# Altium project HC32F005.PrjPCB
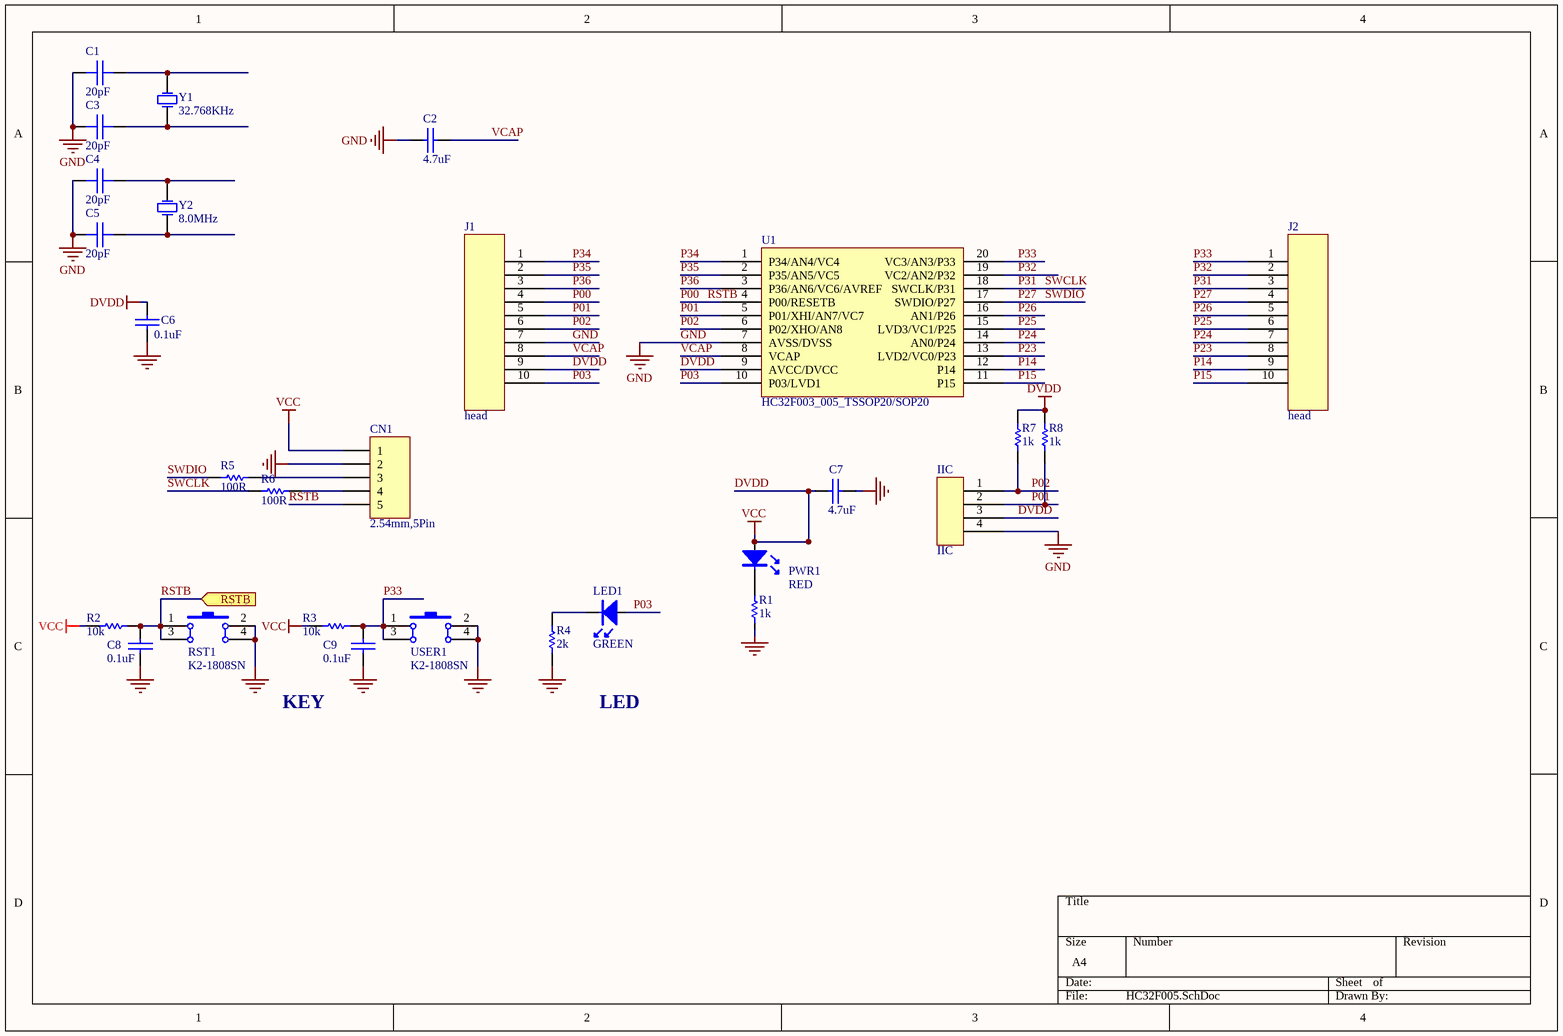
[diagram p0: HC32F005.SchDoc]
1 sheet, 28 parts. Net scope: flat (ports and power ports of the same name join across sheets).
Board file: HC32F005.PcbDoc

## Sheet HC32F005.SchDoc
size A4

### Parts
C1  20pF  [C0603]
C2  4.7uF  [C0603]
C3  20pF  [C0603]
C4  20pF  [C0603]
C5  20pF  [C0603]
C6  0.1uF  [C0603]
C7  4.7uF  [C0603]
C8  0.1uF  [C0603]
C9  0.1uF  [C0603]
CN1  2.54mm,5Pin  [HDR1X5]
IIC  IIC  [HDR1X4]
J1  head  [HDR1*10]
J2  head  [HDR1*10]
LED1  GREEN  [LED0603]
PWR1  RED  [LED0603]
R1  1k  [R0603]
R2  10k  [R0603]
R3  10k  [R0603]
R4  2k  [R0603]
R5  100R  [R0603]
R6  100R  [R0603]
R7  1k  [R0603]
R8  1k  [R0603]
RST1  K2-1808SN  [PUSHBUTTON-4.2*3.25]
U1  HC32F003_005_TSSOP20/SOP20  [TSSOP-20]
USER1  K2-1808SN  [PUSHBUTTON-4.2*3.25]
Y1  32.768KHz  [32.768K]
Y2  8.0MHz  [49s]

### Ports
RSTB (in)

### Nets
DVDD: C6.1 C7.1 CN1.1 IIC.3 J1.9 PWR1.1(A) R2.1 R3.1 R7.1 R8.1 U1.9(AVCC/DVCC)  [also labelled VCC]
GND: C1.1 C2.1 C3.1 C4.2 C5.2 C6.2 C7.2 C8.2 C9.2 CN1.2 IIC.4 J1.7 R1.1 R4.1 RST1.2 RST1.4 U1.7(AVSS/DVSS) USER1.2 USER1.4
P00: C8.1 CN1.5 J1.4 R2.2 RST1.1 RST1.3 U1.4(P00/RESETB) ; port RSTB  [also labelled RSTB]
P01: IIC.2 J1.5 R8.2 U1.5(P01/XHI/AN7/VC7)
P02: IIC.1 J1.6 R7.2 U1.6(P02/XHO/AN8)
P03: J1.10 LED1.1(A) U1.10(P03/LVD1)
P14: J2.9 U1.12(P14)
P15: J2.10 U1.11(P15)
P23: J2.8 U1.13(LVD2/VC0/P23)
P24: J2.7 U1.14(AN0/P24)
P25: J2.6 U1.15(LVD3/VC1/P25)
P26: J2.5 U1.16(AN1/P26)
P27: J2.4 R5.2 U1.17(SWDIO/P27)  [also labelled SWDIO]
P31: J2.3 R6.2 U1.18(SWCLK/P31)  [also labelled SWCLK]
P32: J2.2 U1.19(VC2/AN2/P32)
P33: C9.1 J2.1 R3.2 U1.20(VC3/AN3/P33) USER1.1 USER1.3
P34: J1.1 U1.1(P34/AN4/VC4)
P35: J1.2 U1.2(P35/AN5/VC5)
P36: J1.3 U1.3(P36/AN6/VC6/AVREF)
VCAP: C2.2 J1.8 U1.8(VCAP)
NetC1_2: C1.2 Y1.2
NetC3_2: C3.2 Y1.1
NetC4_1: C4.1 Y2.2
NetC5_1: C5.1 Y2.1
NetCN1_3: CN1.3 R5.1
NetCN1_4: CN1.4 R6.1
NetLED1_2: LED1.2(K) R4.2
NetPWR1_2: PWR1.2(K) R1.2

### Notes on the sheet
- KEY
- LED

### Library data of the parts
C1 C3-C5 = C_no pol: Capacitor without polarity
C2 = CAP-CC(SMD): Capacitor; Value: 4.7uF
C6-C9 = CAP-CC(SMD): Ceramic Capacitor,0603
CN1 = Header 5: Header, 5-Pin; LatestRevisionDate: 17-Jul-2002; LatestRevisionNote: Re-released for DXP Platform.; Publisher: Altium Limited
J1 J2 = Component_1
LED1 PWR1 = LED
R1-R8 = RES: Resister,0603,5%
RST1 USER1 = Button-SMD-6*6: SMD button
Y1 = Crystal_1: 4.0000MHz
Y2 = Crystal: 4.0000MHz